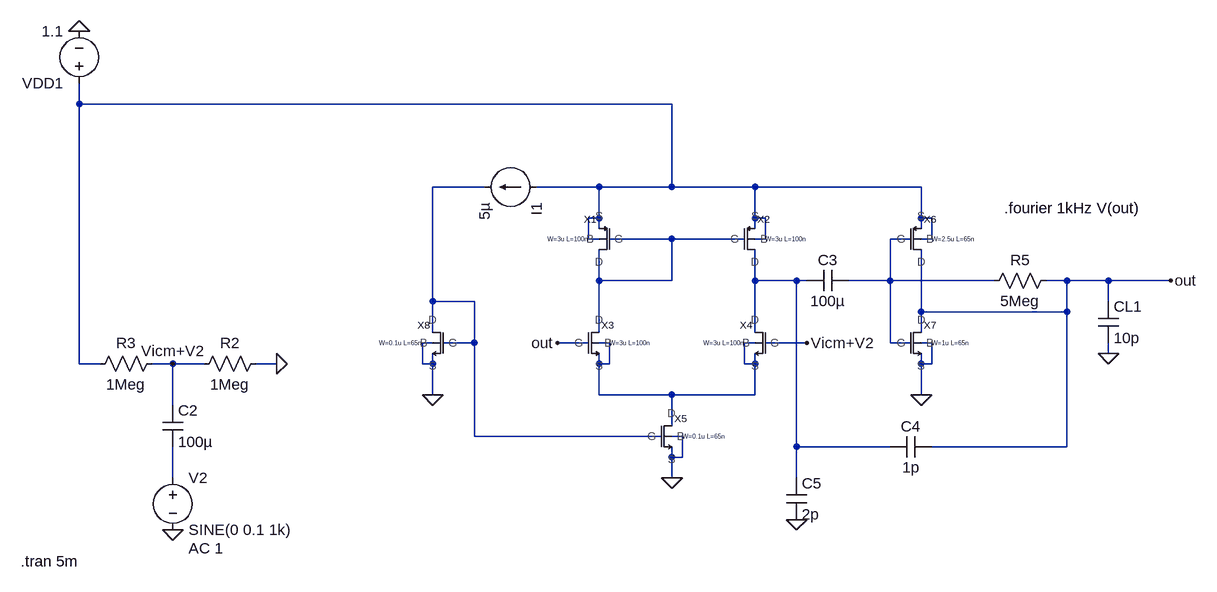
[diagram p0: schematic Draft4.asc]
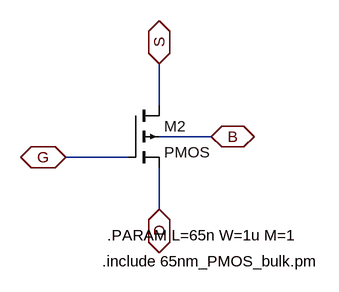
[diagram p1: sub-circuit pmos65.asc]
Draft4.asc, the LTspice schematic file:
Version 4
SHEET 1 1288 680
WIRE -448 -64 -448 -96
WIRE 464 -64 -448 -64
WIRE 176 64 96 64
WIRE 352 64 256 64
WIRE 464 64 464 -64
WIRE 464 64 352 64
WIRE 592 64 464 64
WIRE 848 64 592 64
WIRE 352 112 352 64
WIRE 352 112 336 112
WIRE 592 112 592 64
WIRE 608 112 592 112
WIRE 848 112 848 64
WIRE 864 112 848 112
WIRE 352 128 352 112
WIRE 592 128 592 112
WIRE 848 128 848 112
WIRE 336 144 336 112
WIRE 352 144 336 144
WIRE 464 144 368 144
WIRE 576 144 464 144
WIRE 608 144 608 112
WIRE 608 144 592 144
WIRE 832 144 800 144
WIRE 864 144 864 112
WIRE 864 144 848 144
WIRE 352 208 352 160
WIRE 464 208 464 144
WIRE 464 208 352 208
WIRE 592 208 592 160
WIRE 656 208 592 208
WIRE 672 208 656 208
WIRE 800 208 800 144
WIRE 800 208 736 208
WIRE 960 208 800 208
WIRE 1072 208 1040 208
WIRE 1136 208 1072 208
WIRE 1232 208 1136 208
WIRE 96 240 96 64
WIRE 160 240 96 240
WIRE 1136 240 1136 208
WIRE 848 256 848 160
WIRE 1072 256 1072 208
WIRE 1072 256 848 256
WIRE 96 288 96 240
WIRE 352 288 352 208
WIRE 592 288 592 208
WIRE 848 288 848 256
WIRE 96 304 80 304
WIRE 160 304 160 240
WIRE 160 304 112 304
WIRE 336 304 288 304
WIRE 368 304 352 304
WIRE 592 304 576 304
WIRE 672 304 608 304
WIRE 800 304 800 208
WIRE 832 304 800 304
WIRE 864 304 848 304
WIRE 1136 320 1136 304
WIRE -448 336 -448 -64
WIRE -416 336 -448 336
WIRE -304 336 -336 336
WIRE -256 336 -304 336
WIRE -144 336 -176 336
WIRE 80 336 80 304
WIRE 96 336 96 320
WIRE 96 336 80 336
WIRE 352 336 352 320
WIRE 368 336 368 304
WIRE 368 336 352 336
WIRE 576 336 576 304
WIRE 592 336 592 320
WIRE 592 336 576 336
WIRE 848 336 848 320
WIRE 864 336 864 304
WIRE 864 336 848 336
WIRE 96 384 96 336
WIRE 352 384 352 336
WIRE 464 384 352 384
WIRE 592 384 592 336
WIRE 592 384 464 384
WIRE 848 384 848 336
WIRE -304 400 -304 336
WIRE 464 432 464 384
WIRE 160 448 160 304
WIRE 448 448 160 448
WIRE 480 448 464 448
WIRE 656 464 656 208
WIRE 800 464 656 464
WIRE 1072 464 1072 256
WIRE 1072 464 864 464
WIRE 464 480 464 464
WIRE 480 480 480 448
WIRE 480 480 464 480
WIRE -304 512 -304 464
WIRE 464 512 464 480
WIRE 656 512 656 464
FLAG 464 512 0
FLAG 848 384 0
FLAG 1136 320 0
FLAG -304 592 0
FLAG 672 304 Vicm+V2
FLAG -144 336 0
FLAG -304 336 Vicm+V2
FLAG 96 384 0
FLAG -448 -176 0
FLAG 1232 208 out
FLAG 656 576 0
FLAG 288 304 out
SYMBOL pmos65 336 144 M0
WINDOW 39 0 0 Left 0
SYMATTR SpiceLine W=3u L=100n
SYMATTR InstName X1
SYMBOL pmos65 608 144 R0
WINDOW 39 0 0 Left 0
SYMATTR SpiceLine W=3u L=100n
SYMATTR InstName X2
SYMBOL nmos65 368 304 R0
WINDOW 39 0 0 Left 0
SYMATTR SpiceLine W=3u L=100n
SYMATTR InstName X3
SYMBOL nmos65 576 304 M0
WINDOW 39 0 0 Left 0
SYMATTR SpiceLine W=3u L=100n
SYMATTR InstName X4
SYMBOL nmos65 480 448 R0
WINDOW 39 0 0 Left 0
SYMATTR SpiceLine W=0.1u L=65n
SYMATTR InstName X5
SYMBOL pmos65 864 144 R0
WINDOW 39 0 0 Left 0
SYMATTR SpiceLine W=2.5u L=65n
SYMATTR InstName X6
SYMBOL nmos65 864 304 R0
WINDOW 39 0 0 Left 0
SYMATTR SpiceLine W=1u L=65n
SYMATTR InstName X7
SYMBOL cap 1120 240 R0
SYMATTR InstName CL1
SYMATTR Value 10p
SYMBOL voltage -304 496 R0
WINDOW 123 24 124 Left 2
WINDOW 39 0 0 Left 0
SYMATTR Value2 AC 1
SYMATTR InstName V2
SYMATTR Value SINE(0 0.1 1k)
SYMBOL cap -320 400 R0
SYMATTR InstName C2
SYMATTR Value 100µ
SYMBOL res -272 352 R270
WINDOW 0 32 56 VTop 2
WINDOW 3 0 56 VBottom 2
SYMATTR InstName R2
SYMATTR Value 1Meg
SYMBOL res -432 352 R270
WINDOW 0 32 56 VTop 2
WINDOW 3 0 56 VBottom 2
SYMATTR InstName R3
SYMATTR Value 1Meg
SYMBOL current 256 64 R90
WINDOW 123 0 0 Left 0
WINDOW 39 0 0 Left 0
SYMATTR InstName I1
SYMATTR Value 5µ
SYMBOL nmos65 80 304 M0
WINDOW 39 0 0 Left 0
SYMATTR SpiceLine W=0.1u L=65n
SYMATTR InstName X8
SYMBOL voltage -448 -80 R180
WINDOW 123 0 0 Left 0
WINDOW 39 0 0 Left 0
SYMATTR InstName VDD1
SYMATTR Value 1.1
SYMBOL res 944 224 R270
WINDOW 0 32 56 VTop 2
WINDOW 3 0 56 VBottom 2
SYMATTR InstName R5
SYMATTR Value 5Meg
SYMBOL cap 736 192 R90
WINDOW 0 0 32 VBottom 2
WINDOW 3 32 32 VTop 2
SYMATTR InstName C3
SYMATTR Value 100µ
SYMBOL cap 864 448 R90
WINDOW 0 0 32 VBottom 2
WINDOW 3 32 32 VTop 2
SYMATTR InstName C4
SYMATTR Value 1p
SYMBOL cap 640 512 R0
SYMATTR InstName C5
SYMATTR Value 2p
TEXT 976 96 Left 2 !.fourier 1kHz V(out)
TEXT -538 640 Left 2 !.tran 5m

pmos65.asc, the sub-circuit schematic file:
Version 4
SHEET 1 880 680
WIRE 160 80 160 16
WIRE 240 128 160 128
WIRE 112 160 16 160
WIRE 160 240 160 176
FLAG 16 160 G
IOPIN 16 160 BiDir
FLAG 160 240 D
IOPIN 160 240 BiDir
FLAG 160 16 S
IOPIN 160 16 BiDir
FLAG 240 128 B
IOPIN 240 128 BiDir
SYMBOL pmos4 112 80 R0
SYMATTR InstName M2
SYMATTR Value2 l={L} w={W} ad='2*65n*{W}' as='2*65n*{W}' pd='2*(2*65n+{W})' ps='2*(2*65n+{W})' m={M}
TEXT 80 280 Left 2 !.PARAM L=65n W=1u M=1
TEXT 72 320 Left 2 !.include 65nm_PMOS_bulk.pm

The netlist it stands for:
* Draft4.asc
XX1 N003 N003 N001 N001 pmos65 params: W=3u L=100n
XX2 N003 N005 N001 N001 pmos65 params: W=3u L=100n
XX3 out N003 N006 N006 nmos65 params: W=3u L=100n  ; pins G D S B
XX4 Vicm+V2 N005 N006 N006 nmos65 params: W=3u L=100n  ; pins G D S B
XX5 N002 N006 0 0 nmos65 params: W=0.1u L=65n  ; pins G D S B
XX6 N004 out N001 N001 pmos65 params: W=2.5u L=65n
XX7 N004 out 0 0 nmos65 params: W=1u L=65n  ; pins G D S B
CL1 out 0 10p
V2 N007 0 SINE(0 0.1 1k) AC 1
C2 Vicm+V2 N007 100µ
R2 Vicm+V2 0 1Meg
R3 N001 Vicm+V2 1Meg
I1 N001 N002 5µ
XX8 N002 N002 0 0 nmos65 params: W=0.1u L=65n  ; pins G D S B
VDD1 N001 0 1.1
R5 N004 out 5Meg
C3 N004 N005 100µ
C4 out N005 1p
C5 N005 0 2p

* block symbol definitions
.subckt pmos65 G D S B
M2 S G D B PMOS l={L} w={W} ad='2*65n*{W}' as='2*65n*{W}' pd='2*(2*65n+{W})' ps='2*(2*65n+{W})' m={M}
.PARAM L=65n W=1u M=1
.include 65nm_PMOS_bulk.pm
.ends pmos65

.model NMOS NMOS
.model PMOS PMOS
.lib standard.mos
.fourier 1kHz V(out)
.tran 5m
.backanno
.end